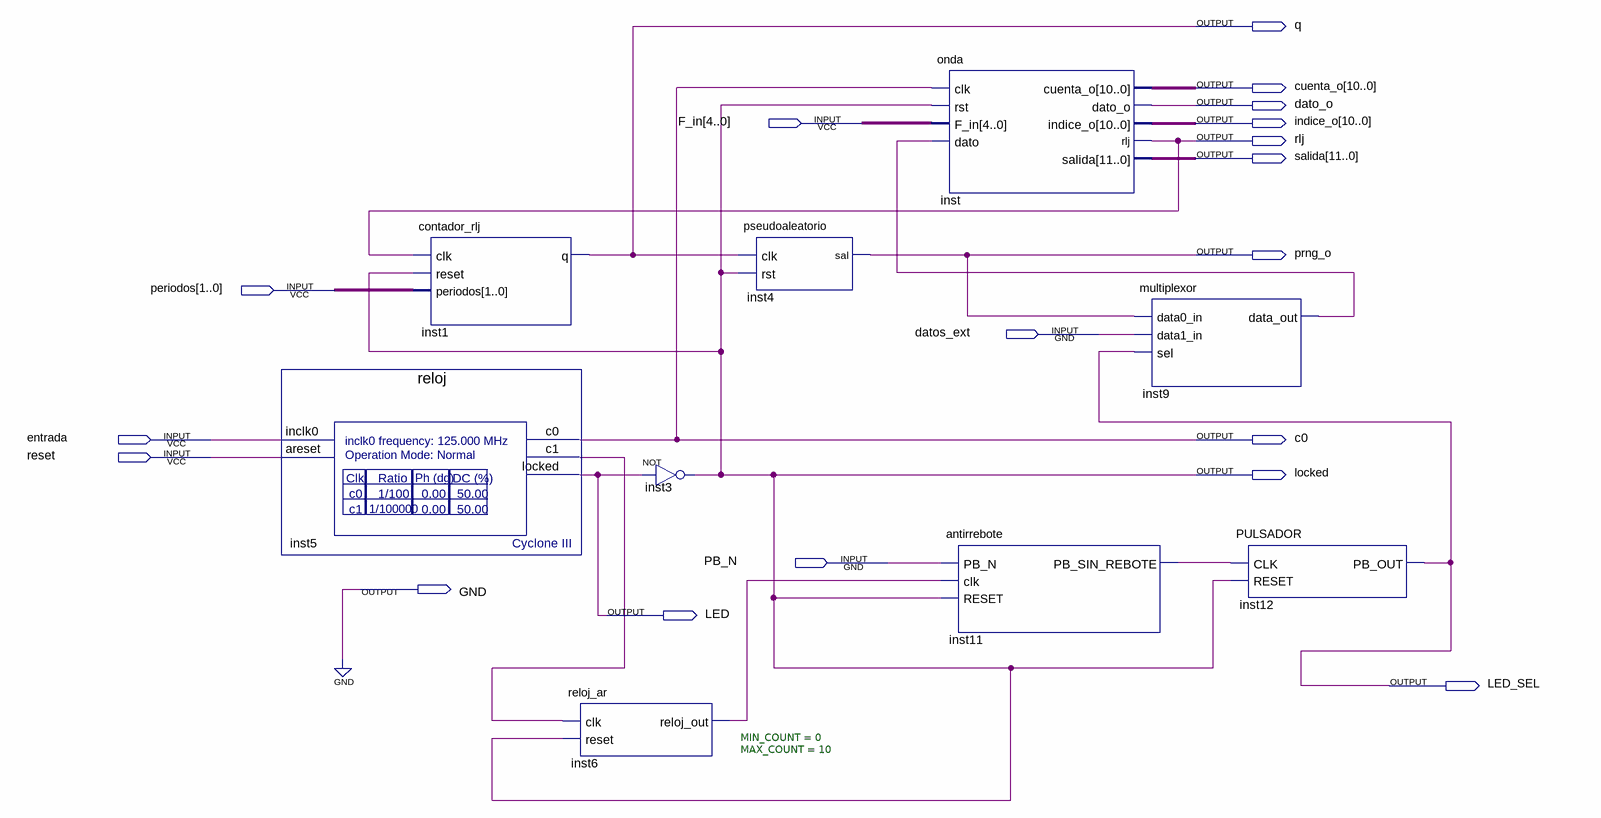
[diagram p0: schematic sheet]
// Quartus schematic moduladorSCH.bdf as structural Verilog: 9 symbols, 18 pins
module moduladorSCH (
  input  [4:0] F_in,
  input  [1:0] periodos,
  input  datos_ext,
  input  entrada,
  input  reset,
  input  PB_N,
  output q,
  output [10:0] cuenta_o,
  output dato_o,
  output [10:0] indice_o,
  output rlj,
  output [11:0] salida,
  output prng_o,
  output c0,
  output locked,
  output GND,
  output LED,
  output LED_SEL
);

  wire inst5_c1, inst6_reloj_out, inst9_data_out, inst11_pb_sin_rebote;

  reloj inst5 (.inclk0(entrada), .areset(reset), .c0(c0), .c1(inst5_c1), .locked(LED));
  contador_rlj inst1 (.clk(rlj), .reset(locked), .periodos(periodos), .q(q));
  reloj_ar #(.MIN_COUNT(0), .MAX_COUNT(10)) inst6 (.clk(inst5_c1), .reset(locked), .reloj_out(inst6_reloj_out));
  not inst3 (locked, LED);
  pseudoaleatorio inst4 (.clk(q), .rst(locked), .sal(prng_o));
  onda inst (
    .clk(c0), .rst(locked), .F_in(F_in), .dato(inst9_data_out), .cuenta_o(cuenta_o), .dato_o(dato_o),
    .indice_o(indice_o), .rlj(rlj), .salida(salida));
  antirrebote inst11 (.PB_N(PB_N), .clk(inst6_reloj_out), .RESET(locked), .PB_SIN_REBOTE(inst11_pb_sin_rebote));
  multiplexor inst9 (.data0_in(prng_o), .data1_in(datos_ext), .sel(LED_SEL), .data_out(inst9_data_out));
  PULSADOR inst12 (.CLK(inst11_pb_sin_rebote), .RESET(locked), .PB_OUT(LED_SEL));

  assign GND = 1'b0;
endmodule
